# EAGLE design calculator7 (EAGLE 9.6.2)
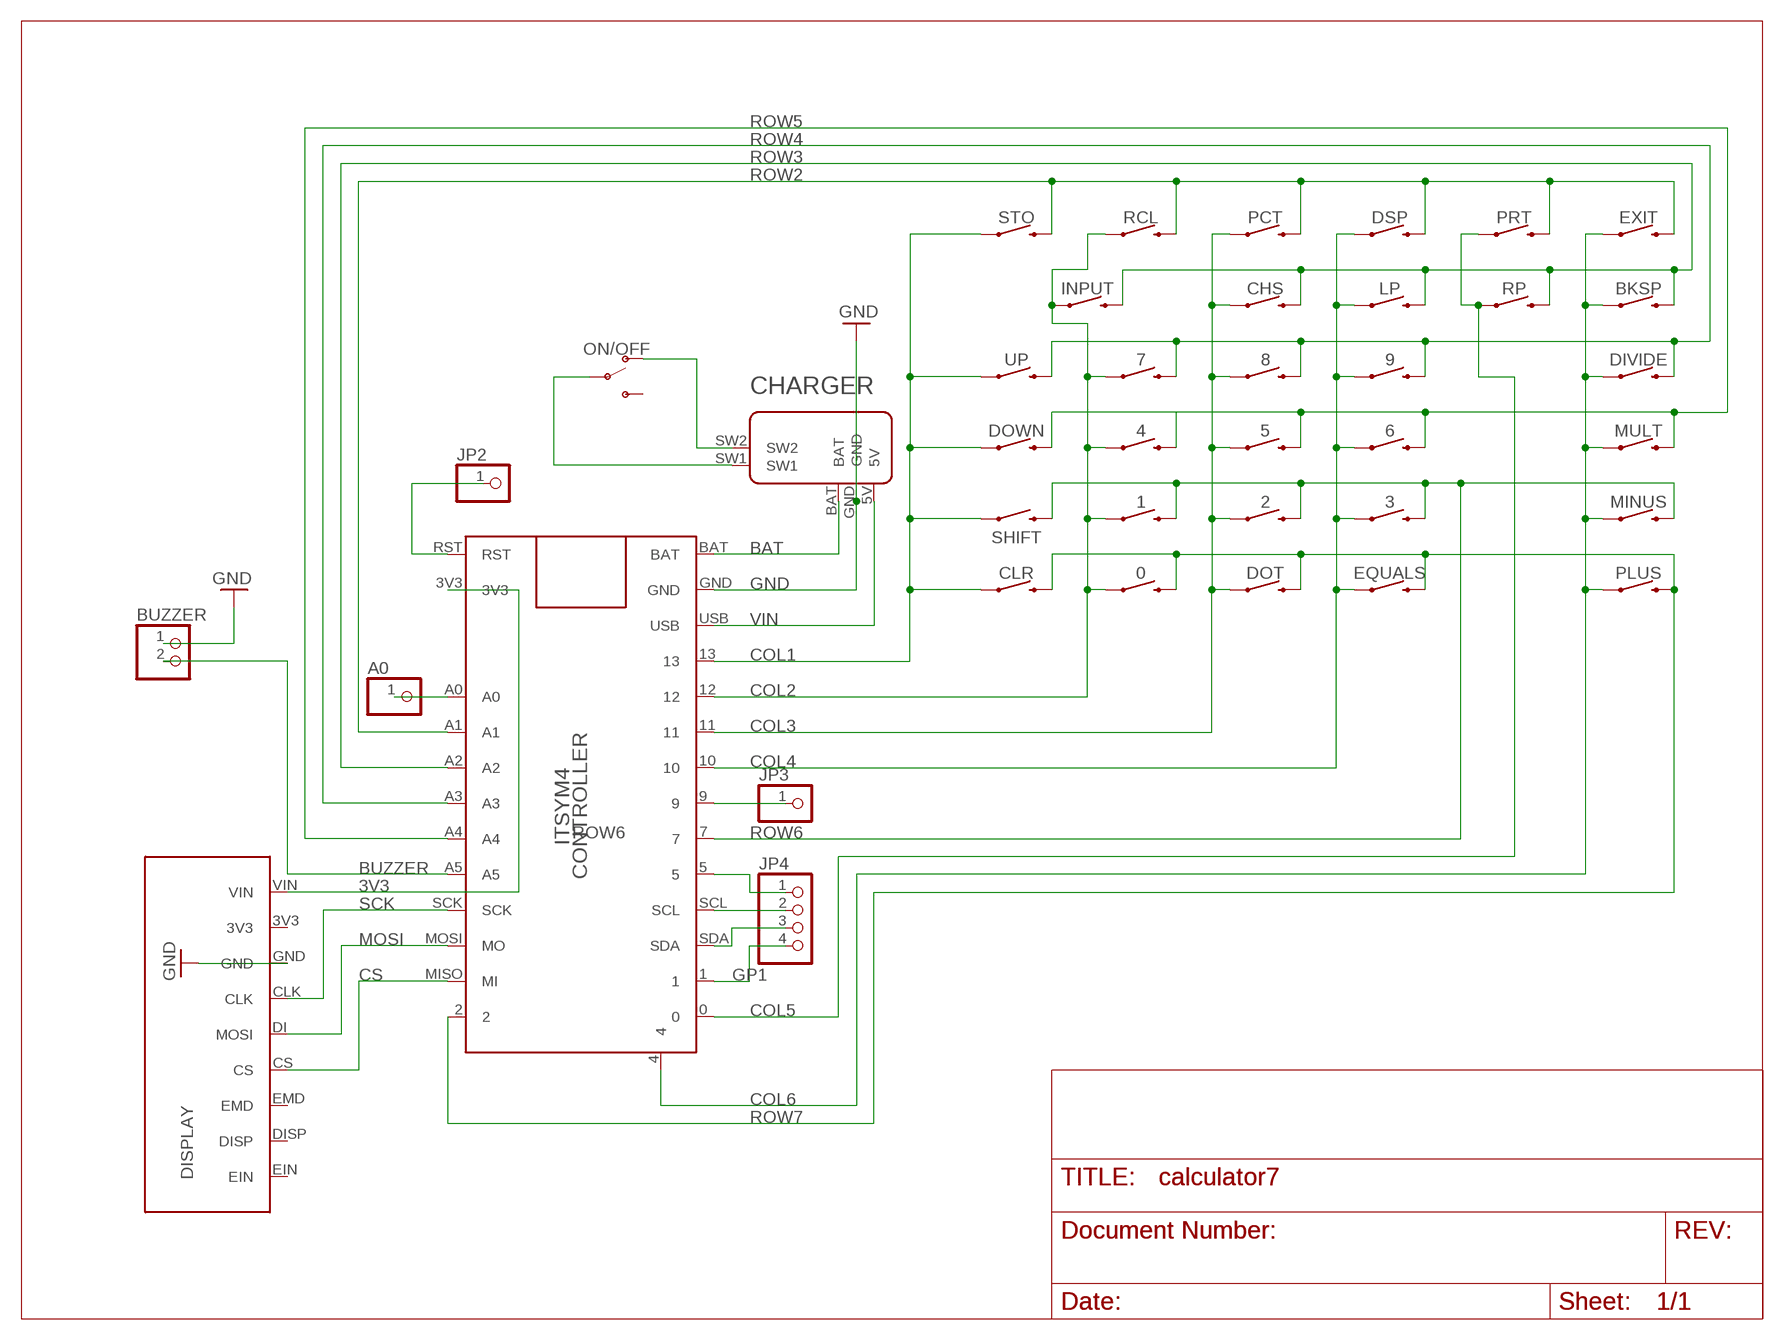
[diagram p0: schematic, sheet 1]

## Parts
0  3BUTTON  [3BUTTON]
1  3BUTTON  [3BUTTON]
2  3BUTTON  [3BUTTON]
3  3BUTTON  [3BUTTON]
4  3BUTTON  [3BUTTON]
5  3BUTTON  [3BUTTON]
6  3BUTTON  [3BUTTON]
7  3BUTTON  [3BUTTON]
8  3BUTTON  [3BUTTON]
9  3BUTTON  [3BUTTON]
A0  PINHD-1X1  [1X01]
BKSP  3BUTTON  [3BUTTON]
BUZZER  PINHD-1X2  [1X02]
CHARGER  LIPO_BACKPACK  [LIPO_BACKPACK]
CHS  3BUTTON  [3BUTTON]
CLR  3BUTTON  [3BUTTON]
CONTROLLER  ITSYM4  [ITSYM4]
DISPLAY  SHARPMEM_FULL  [SHARPMEM_FULL]
DIVIDE  3BUTTON  [3BUTTON]
DOT  3BUTTON  [3BUTTON]
DOWN  3BUTTON  [3BUTTON]
DSP  3BUTTON  [3BUTTON]
EQUALS  3BUTTON  [3BUTTON]
EXIT  3BUTTON  [3BUTTON]
INPUT  3BUTTON  [3BUTTON]
JP2  PINHD-1X1  [1X01]
JP3  PINHD-1X1  [1X01]
JP4  PINHD-1X4  [1X04]
LP  3BUTTON  [3BUTTON]
MINUS  3BUTTON  [3BUTTON]
MULT  3BUTTON  [3BUTTON]
ON/OFF  LIL_SWITCH  [LIL_SWITCH]
PCT  3BUTTON  [3BUTTON]
PLUS  3BUTTON  [3BUTTON]
PRT  3BUTTON  [3BUTTON]
RCL  3BUTTON  [3BUTTON]
RP  3BUTTON  [3BUTTON]
SHIFT  3BUTTON  [3BUTTON]
STO  3BUTTON  [3BUTTON]
UP  3BUTTON  [3BUTTON]

## Nets
3V3: CONTROLLER.3V3 DISPLAY.VIN
A0: A0.1 CONTROLLER.A0
BAT: CHARGER.BAT CONTROLLER.BAT
BUZZER: BUZZER.2 CONTROLLER.A5
COL1: CLR.P1 CONTROLLER.13 DOWN.P1 SHIFT.P1 STO.P1 UP.P1
COL2: 0.P1 1.P1 4.P1 7.P1 CONTROLLER.12 INPUT.P1 RCL.P1
COL3: 2.P1 5.P1 8.P1 CHS.P1 CONTROLLER.11 DOT.P1 PCT.P1
COL4: 3.P1 6.P1 9.P1 CONTROLLER.10 DSP.P1 EQUALS.P1 LP.P1
COL5: CONTROLLER.0 PRT.P1 RP.P1
COL6: BKSP.P1 CONTROLLER.4 DIVIDE.P1 EXIT.P1 MINUS.P1 MULT.P1 PLUS.P1
CS: CONTROLLER.MISO(MI) DISPLAY.CS
GND: BUZZER.1 CHARGER.GND CONTROLLER.GND DISPLAY.GND
GP1: CONTROLLER.1 JP4.4
GP5: CONTROLLER.5 JP4.1
GP9: CONTROLLER.9 JP3.1
MOSI: CONTROLLER.MOSI(MO) DISPLAY.DI(MOSI)
N$1: CHARGER.SW1 ON/OFF.COM
N$2: CHARGER.SW2 ON/OFF.P1
ROW2: CONTROLLER.A1 DSP.P2 EXIT.P2 PCT.P2 PRT.P2 RCL.P2 STO.P2
ROW3: BKSP.P2 CHS.P2 CONTROLLER.A2 INPUT.P2 LP.P2 RP.P2
ROW4: 7.P2 8.P2 9.P2 CONTROLLER.A3 DIVIDE.P2 UP.P2
ROW5: 4.P2 5.P2 6.P2 CONTROLLER.A4 DOWN.P2 MULT.P2
ROW6: 1.P2 2.P2 3.P2 CONTROLLER.7 MINUS.P2 SHIFT.P2
ROW7: 0.P2 CLR.P2 CONTROLLER.2 DOT.P2 EQUALS.P2 PLUS.P2
RST: CONTROLLER.RST JP2.1
SCK: CONTROLLER.SCK DISPLAY.CLK
SCL: CONTROLLER.SCL JP4.2
SDA: CONTROLLER.SDA JP4.3
VIN: CHARGER.5V CONTROLLER.USB
Unconnected: DISPLAY.3V3 DISPLAY.DISP DISPLAY.EIN DISPLAY.EMD ON/OFF.P2

## Library data of the parts
0 1-9 BKSP CHS CLR DIVIDE DOT DOWN DSP EQUALS EXIT INPUT LP MINUS MULT PCT PLUS PRT RCL RP SHIFT STO UP = aaa_pw:3BUTTON
A0 JP2 JP3 = pinhead:PINHD-1X1: PIN HEADER
BUZZER = pinhead:PINHD-1X2: PIN HEADER
CHARGER = aaa_pw:LIPO_BACKPACK
CONTROLLER = aaa_pw:ITSYM4
DISPLAY = aaa_pw:SHARPMEM_FULL
JP4 = pinhead:PINHD-1X4: PIN HEADER
ON/OFF = aaa_pw:LIL_SWITCH

## Board
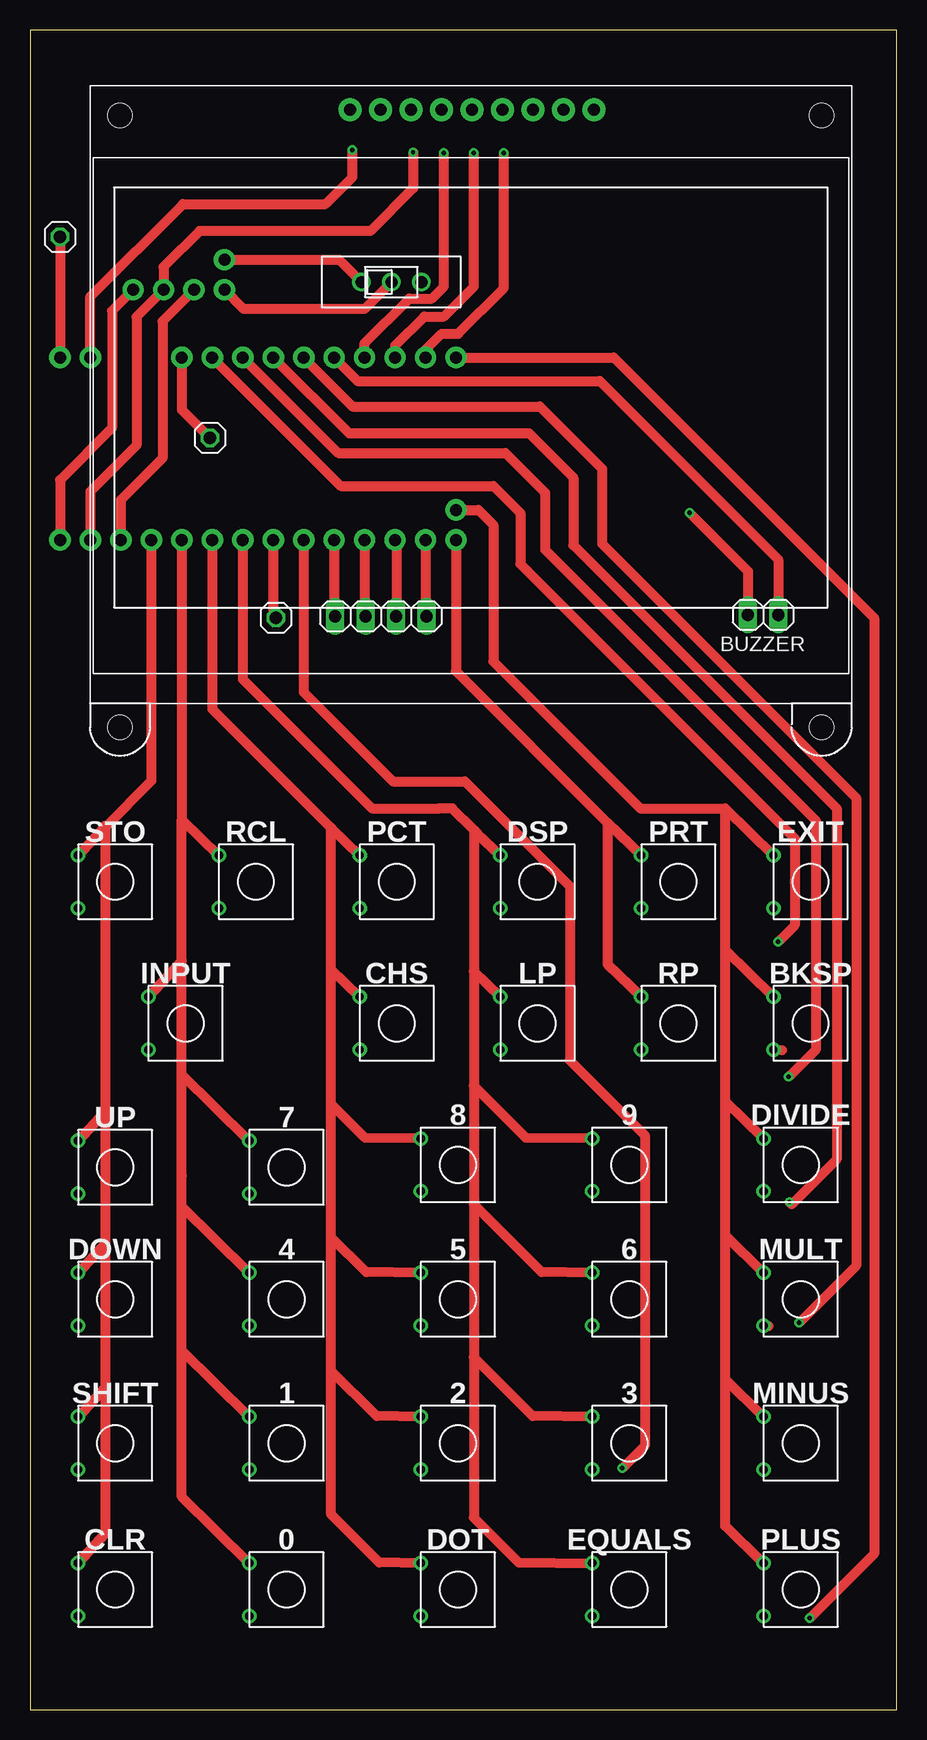
[diagram p1: board, top side]
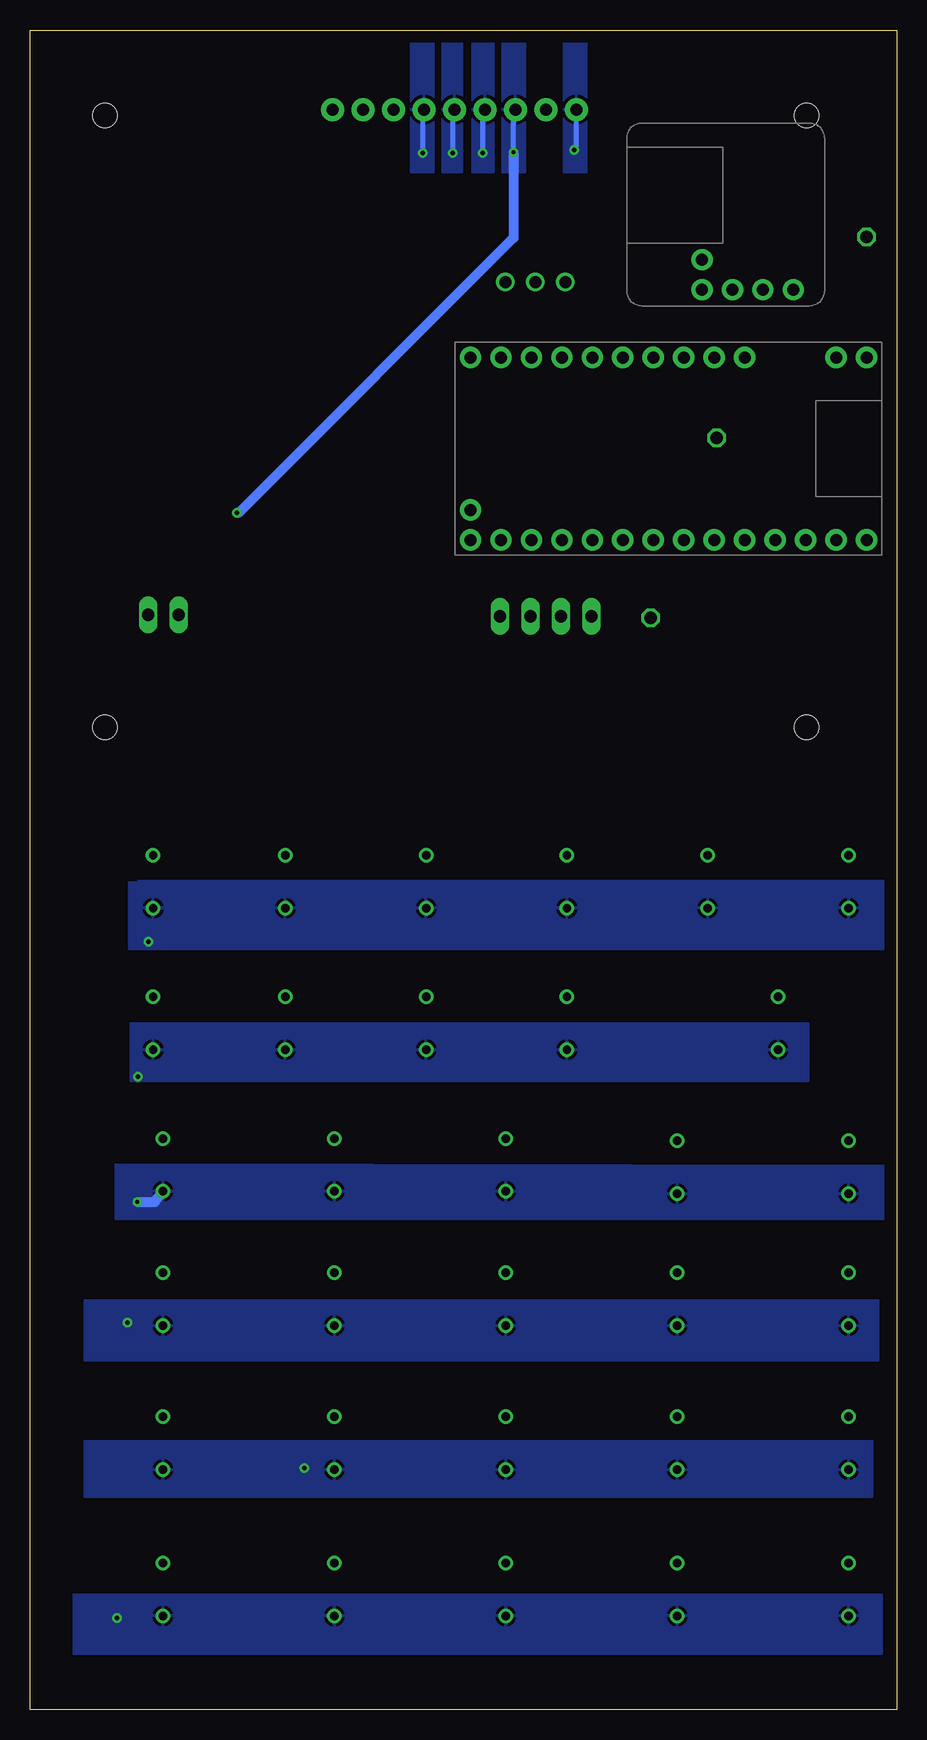
[diagram p2: board, bottom side, seen from below]

Size 72.25 x 140 mm. Coordinates in mm from the lower left corner, seen from the top.
Outline: 0,0 72.25,0 72.25,140 0,140 0,0
Copper layers (1*16): Top 0.035mm / dielectric 1.5mm / Bottom 0.035mm
Design rules "default": minimum track width 6mil, minimum drill 0.35mm, track to track 6mil, track to pad 6mil, pad to pad 6mil, via to via 6mil, smd to smd 6mil, copper to edge 40mil, drill to drill 6mil, minimum pad ring 10mil, minimum via ring 8mil, stop-mask expansion 4mil, vias tented up to drill 0mil, thermal gap 10mil

### Footprints (pad centres in the part's own frame; a part is rotated, then mirrored left to right if it is on the bottom)
3BUTTON = drill 0.7: P1 -3.1,2.2; P2 -3.1,-2.2
1X01 = drill 1.016 octagon: 1 0,0
1X02 = drill 1.016 long: 1 -1.27,0; 2 1.27,0
LIPO_BACKPACK = drill 1 pad 1.778: 5V 7.68,13.9; BAT 2.6,13.9; GND 5.14,13.9; SW1 10.22,13.9; SW2 10.22,11.4
ITSYM4 = drill 1 pad 1.778: 0 34.27,16.5; 1 31.73,16.5; 2 34.27,1.3; 3V3 3.79,1.3; 4 34.27,14; 5 24.11,16.5; 7 21.57,16.5; 9 19.03,16.5; 10 16.49,16.5; 11 13.95,16.5; 12 11.41,16.5; 13 8.87,16.5; A0 11.41,1.3; A1 13.95,1.3; A2 16.49,1.3; A3 19.03,1.3; A4 21.57,1.3; A5 24.11,1.3; BAT 1.25,16.5; GND 3.79,16.5; MISO 31.73,1.3; MOSI 29.19,1.3; RST 1.25,1.3; SCK 26.65,1.3; SCL 26.65,16.5; SDA 29.19,16.5; USB 6.33,16.5
SHARPMEM_FULL = drill 1 pad 1.93: 3V3 24.23,49.49; CLK 29.31,49.49; CS 34.39,49.49; DI 31.85,49.49; DISP 39.47,49.49; EIN 42.01,49.49; EMD 36.93,49.49; GND 26.77,49.49; VIN 21.69,49.49 | hole 2: 2.5,49; 61,49; 2.5,-2; 61,-2
1X04 = drill 1.016 long: 1 -3.81,0; 2 -1.27,0; 3 1.27,0; 4 3.81,0
LIL_SWITCH = drill 1: COM 0,0; P1 -2.5,0; P2 2.5,0

### Placement (x,y rotation side)
0  21.39,10 0 top
1  21.39,22.2 0 top
2  35.68,22.2 0 top
3  49.97,22.2 0 top
4  21.39,34.2 0 top
5  35.68,34.2 0 top
6  49.97,34.2 0 top
7  21.39,45.2 0 top
8  35.68,45.4 0 top
9  49.97,45.4 0 top
A0  15,106 0 top
BKSP  65.08,57.2 0 top
BUZZER  61.12,91.25 0 top
CHARGER  6,132.25 180 bottom
CHS  30.58,57.2 0 top
CLR  7.1,10 0 top
CONTROLLER  1.25,114 180 bottom
DISPLAY  5,83.88 0 top
DIVIDE  64.26,45.4 0 top
DOT  35.68,10 0 top
DOWN  7.1,34.2 0 top
DSP  42.32,69 0 top
EQUALS  49.97,10 0 top
EXIT  65.08,69 0 top
INPUT  12.97,57.2 0 top
JP2  2.5,122.75 0 top
JP3  20.5,91 0 top
JP4  29.25,91.12 0 top
LP  42.32,57.2 0 top
MINUS  64.26,22.2 0 top
MULT  64.26,34.2 0 top
ON/OFF  30.12,119 0 top
PCT  30.58,69 0 top
PLUS  64.26,10 0 top
PRT  54.06,69 0 top
RCL  18.84,69 0 top
RP  54.06,57.2 0 top
SHIFT  7.1,22.2 0 top
STO  7.1,69 0 top
UP  7.1,45.2 0 top

### Tracks (layer width: path | path; a pad name or v marks a point on that pad's centre or on a via)
3V3  (via drill 0.35)
  Top 0.813: CONTROLLER.3V3 5.04,117.79 12.75,125.5 24.62,125.5 26.88,127.75 v26.88,130
  Bottom 0.406: v26.88,130 26.69,130.19 DISPLAY.VIN
  pour Bottom: 27.75,128.12 27.75,139.62 25.88,139.62 25.88,128.12
A0
  Top 0.813: CONTROLLER.A0 12.66,108.34 A0.1
BAT
  Top 0.813: CHARGER.BAT 6.85,116.6 6.85,106.85 2.5,102.5 CONTROLLER.BAT
BUZZER
  Top 0.813: CONTROLLER.A5 27.31,110.75 47.5,110.75 62.4,95.86 BUZZER.2
COL1
  Top 0.813: CONTROLLER.13 10.12,77.41 6.25,73.54 | CLR.P1 6.25,14.66 6.25,26.86 | 6.25,73.54 6.25,73.66 STO.P1 | 6.25,73.54 6.25,49.86 | 6.25,49.86 6.25,38.86 | 6.25,38.86 6.25,26.86 | SHIFT.P1 6.25,26.86 | DOWN.P1 6.25,38.86 | UP.P1 6.25,49.86
COL2
  Top 0.813: CONTROLLER.12 12.66,74.19 | 12.66,74.19 RCL.P1 | INPUT.P1 12.66,62.4 | 12.66,62.4 12.66,74.19 | 7.P1 12.66,52.94 | 12.66,52.94 12.66,62.4 | 0.P1 12.66,17.74 12.66,29.94 | 12.66,29.94 12.66,41.94 | 12.66,52.94 12.66,44.5 12.66,41.94 | 1.P1 12.66,29.94 | 4.P1 12.66,41.94
COL3
  Top 0.813: CONTROLLER.11 15.2,83.39 25.11,73.48 | 25.11,73.48 PCT.P1 | 25.11,28.25 25.11,39.38 | 25.11,39.38 25.11,50.5 | 25.11,50.5 25.11,61.68 | 25.11,61.68 25.11,73.48 | CHS.P1 25.11,61.68 | 8.P1 27.95,47.66 25.11,50.5 | 5.P1 28.02,36.46 25.11,39.38 | 2.P1 28.9,24.46 25.11,28.25 | DOT.P1 29.11,12.26 25.11,16.27 25.11,28.25
COL4
  Top 0.813: 37,73.33 37,61.53 | 37,61.53 37,52 | 37,52 37,42.12 | 37,42.12 37,29.38 | 37,29.38 37,16 40.74,12.26 EQUALS.P1 | 3.P1 41.91,24.46 37,29.38 | 6.P1 42.66,36.46 37,42.12 | 9.P1 41.34,47.66 37,52 | LP.P1 37,61.53 | DSP.P1 37.29,73.04 37,73.33 | CONTROLLER.10 17.74,85.89 28.5,75.12 34.12,75.12 35.2,75.12 37,73.33
COL5
  Top 0.813: CONTROLLER.0 35.52,86.55 48.16,73.91 | 48.16,73.91 PRT.P1 | 48.16,73.91 48.16,62.11 RP.P1
COL6
  Top 0.813: CONTROLLER.4 37.38,100 38.62,98.75 38.62,87.38 50.88,75.12 57.96,75.12 | 57.96,75.12 EXIT.P1 | BKSP.P1 57.96,63.33 | 57.96,63.33 57.96,75.12 | DIVIDE.P1 57.96,50.7 | 57.96,50.7 57.96,63.33 | PLUS.P1 57.96,15.3 57.96,27.5 | 57.96,27.5 57.96,39.51 | 57.96,39.51 57.96,50.7 | MINUS.P1 57.96,27.5 | MULT.P1 57.96,39.51
CS  (via drill 0.35)
  Top 0.813: CONTROLLER.MISO 32.98,113.36 34.31,114.69 35.69,114.69 39.5,118.5 v39.5,129.75
  Bottom 0.406: v39.5,129.75 39.5,133.25 DISPLAY.CS
  pour Bottom: 40.5,128.12 40.5,139.62 38.62,139.62 38.62,128.12
GND  (via drill 0.35)
  Top 0.813: CONTROLLER.GND 5.04,101.54 8.89,105.39 8.89,116.1 CHARGER.GND 11.14,120.27 14.12,123.25 28.38,123.25 31.94,126.81 v31.94,129.81 | v55,99.75 59.85,94.89 BUZZER.1
  Bottom 0.406: 31.92,129.96 32,129.88 v31.94,129.81 31.94,133.2 DISPLAY.GND
  Bottom 0.813: v31.94,129.81 31.94,122.69 54.88,99.75 v55,99.75
  pour Bottom: 32.88,139.62 31,139.62 31,128.12 32.88,128.12
GP1
  Top 0.813: CONTROLLER.1 32.98,91.2 JP4.4
GP5
  Top 0.813: CONTROLLER.5 25.36,91.2 JP4.1
GP9
  Top 0.813: CONTROLLER.9 20.28,91.22 JP3.1
MOSI  (via drill 0.35)
  Top 0.813: CONTROLLER.MOSI 30.44,113.69 32.88,116.12 34.5,116.12 37,118.62 v37,129.75
  Bottom 0.406: v37,129.75 37,133.22 DISPLAY.DI
  pour Bottom: 37.88,128.12 37.88,139.62 36.25,139.62 36.25,128.12
N$1
  Top 0.813: ON/OFF.COM 27.88,116.75 17.82,116.75 CHARGER.SW1
N$2
  Top 0.813: CHARGER.SW2 25.77,120.85 ON/OFF.P1
ROW2  (via drill 0.35)
  Top 0.813: CONTROLLER.A1 25.9,102 38.62,102 40.88,99.75 40.88,95.5 63.75,72.62 63.75,65.38 v62.38,64
  pour Bottom: 63.25,69.12 0.62,69.12 0.62,66 0.62,63.38 64,63.38 64,69 63.12,69
ROW3  (via drill 0.35)
  Top 0.813: CONTROLLER.A2 25.69,104.75 39.62,104.75 42.94,101.44 42.94,96.69 65.5,74.12 65.5,55 v63.25,52.75 | 62.69,54.94 BKSP.P2
  pour Bottom: 63.88,57.25 7.38,57.25 7.38,52.88 7.38,52.38 63.88,52.38 63.88,57.12
ROW4  (via drill 0.35)
  Top 0.813: CONTROLLER.A3 26.61,106.38 41.62,106.38 45.3,102.69 45.3,97.06 67.25,75.11 67.25,45.88 63.5,42.12 v63.31,42.31
  Bottom 0.813: v63.31,42.31 61.84,42.31 DIVIDE.P2
  pour Bottom: 0.62,45.37 0.62,40.88 65.12,40.88 65.12,45.5
ROW5  (via drill 0.35)
  Top 0.813: CONTROLLER.A4 26.89,108.62 42.5,108.62 47.69,103.44 47.69,97.19 68.88,76 68.88,37 v64.12,32.25 | 61.56,31.94 MULT.P2
  pour Bottom: 1.5,34.12 67.75,34.12 67.75,31.12 67.75,29.12 1.5,29.12 1.5,34
ROW6  (via drill 0.35)
  Top 0.813: v49.38,20.12 51.25,22 51.25,47.88 45,54.12 45,68.62 36.25,77.38 30.25,77.38 22.82,84.81 CONTROLLER.7
  pour Bottom: 2,22.38 67.75,22.38 67.75,17.75 2,17.75
ROW7  (via drill 0.35)
  Top 0.813: CONTROLLER.2 48.67,112.7 70.38,91 70.38,13 v65,7.62
  pour Bottom: 68.5,9.62 1.25,9.62 1.25,6.5 1.25,4.62 68.62,4.62 68.62,9.62
RST
  Top 0.813: JP2.1 CONTROLLER.RST
SCK  (via drill 0.35)
  Top 0.813: CONTROLLER.SCK 27.9,113.9 31.62,117.62 33.5,117.62 34.5,118.62 v34.5,129.75
  Bottom 0.406: 34.46,129.79 v34.5,129.75 34.5,133.18 DISPLAY.CLK
  pour Bottom: 35.38,128.12 35.38,139.62 33.62,139.62 33.62,128.12
SCL
  Top 0.813: CONTROLLER.SCL 27.9,91.2 JP4.2
SDA
  Top 0.813: CONTROLLER.SDA 30.57,97.38 30.57,91.17 JP4.3
VIN
  Top 0.813: CHARGER.5V 11.05,115.72 11.05,104.31 7.58,100.83 CONTROLLER.USB